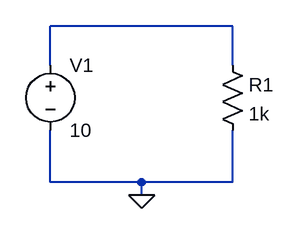
[diagram p0: schematic ohms-law.asc]
ohms-law.asc, the LTspice schematic file:
Version 4.1
SHEET 1 880 680
WIRE 256 32 32 32
WIRE 32 80 32 32
WIRE 256 80 256 32
WIRE 32 224 32 160
WIRE 144 224 32 224
WIRE 256 224 256 160
WIRE 256 224 144 224
WIRE 144 240 144 224
FLAG 144 240 0
SYMBOL voltage 32 64 R0
SYMATTR InstName V1
SYMATTR Value 10
SYMBOL res 240 64 R0
SYMATTR InstName R1
SYMATTR Value 1k

The netlist it stands for:
* ohms-law.asc
V1 N001 0 10
R1 N001 0 1k
.backanno
.end